# EAGLE design 235_temperature (EAGLE 9.6.2)
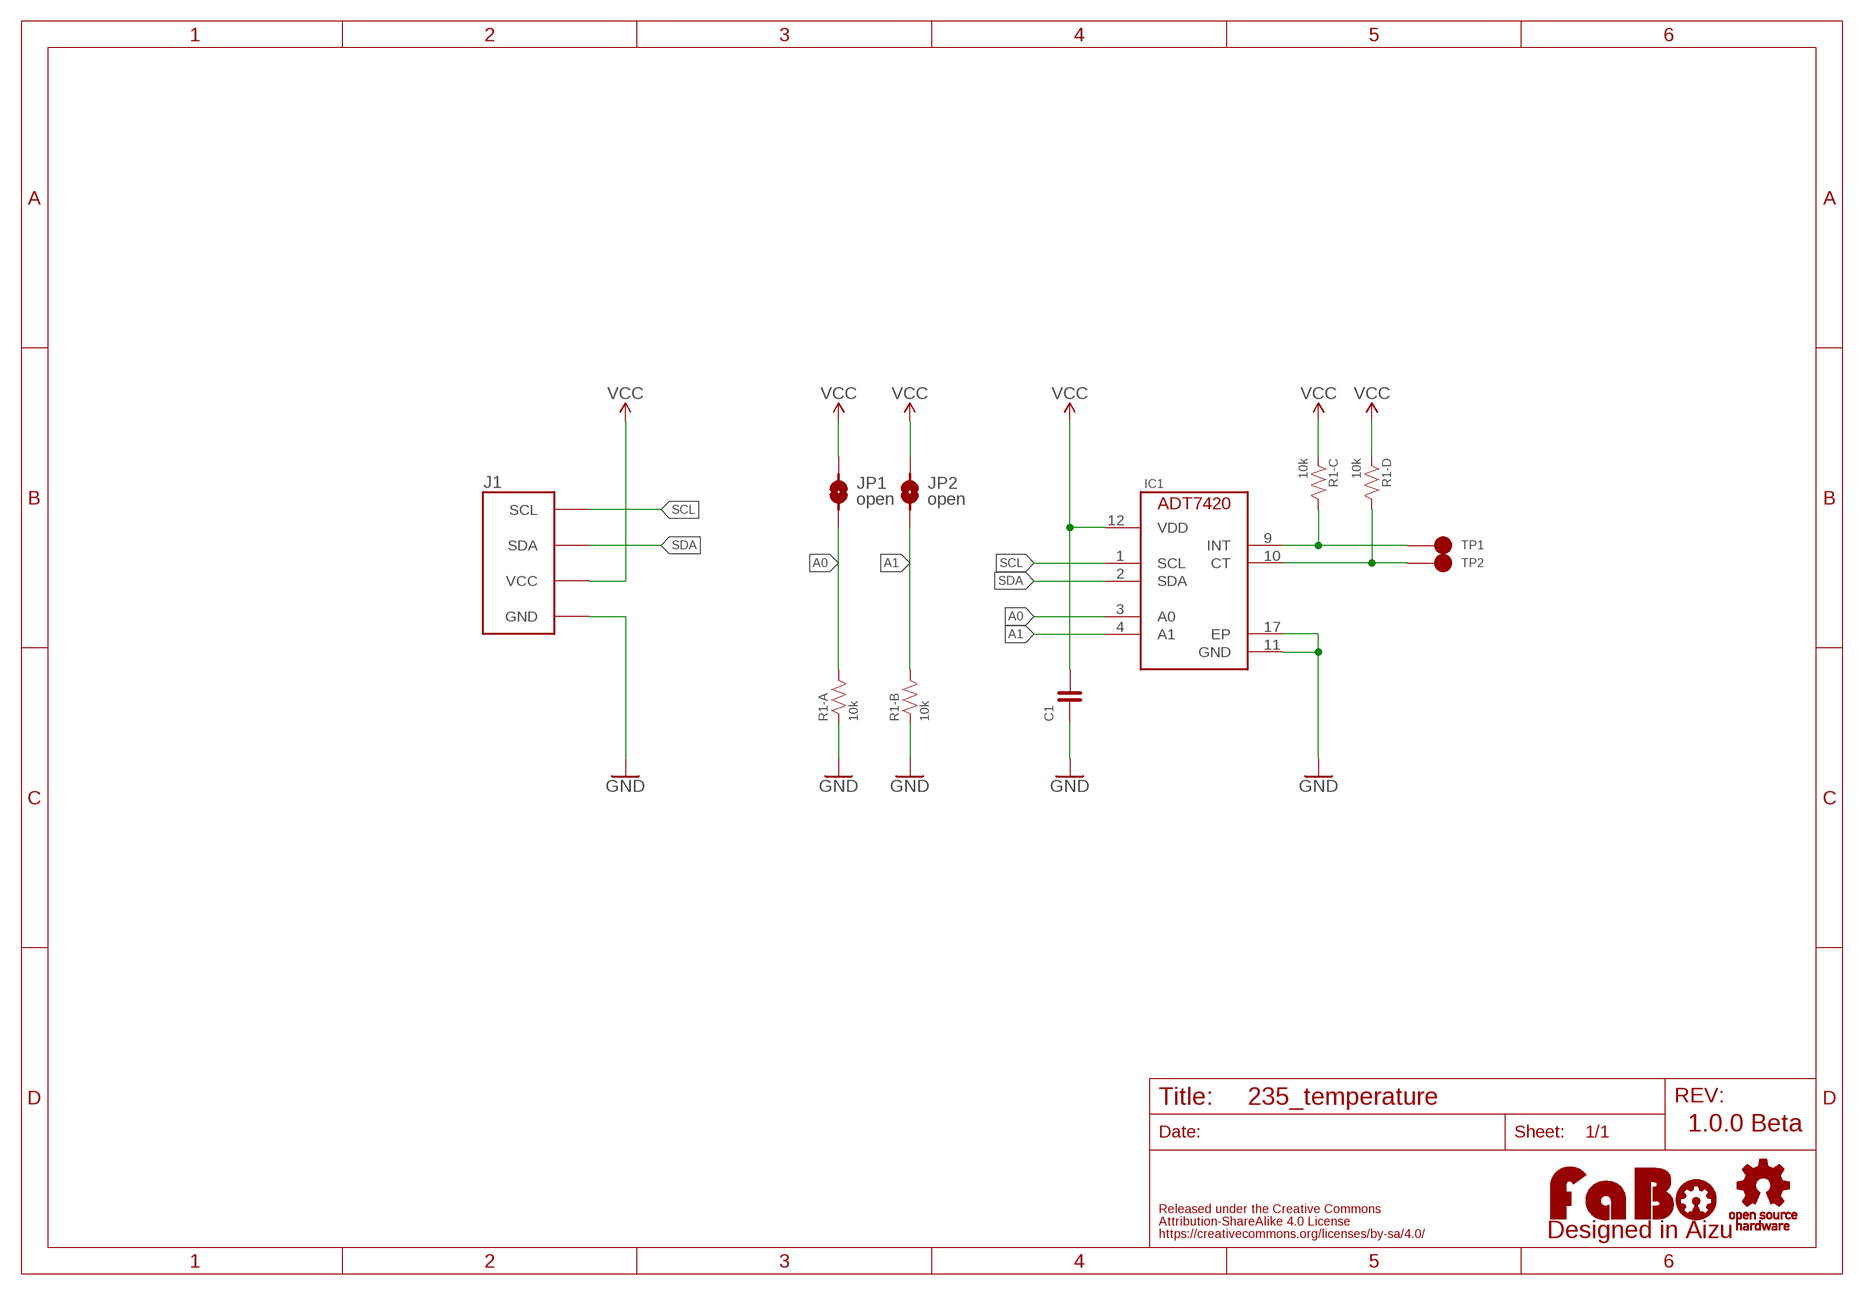
[diagram p0: schematic, sheet 1]

## Parts
C1  CAPACITOR-0603  [EIA0603]
IC1  ADT7420  [ADT7420]
J1  FABO_BRICK_I2C  [FABO_BRICK_I2C]
JP1  open  JUMPER-2_SMD  [JUMPER-SMD-2]
JP2  open  JUMPER-2_SMD  [JUMPER-SMD-2]
LOGO1  LOGO_FABO-M  [LOGO_FABO_M]
R1  10k  RESISTOR_ARRAY_4  [EXBV8V]
TP1  TP-15  [TP-15]
TP2  TP-15  [TP-15]
U$2  LOGO_OSHW-M_BOTTOM  [LOGO_OSHW_M_BOTTOM]

## Nets
A0: IC1.3(A0) JP1.2 R1.8
A1: IC1.4(A1) JP2.2 R1.7
CT: IC1.10(CT) R1.5 TP2.1
GND: C1.1 IC1.11(GND) IC1.17(EP) J1.GND R1.1 R1.2
INT: IC1.9(INT) R1.6 TP1.1
SCL: IC1.1(SCL) J1.SCL
SDA: IC1.2(SDA) J1.SDA
VCC: C1.2 IC1.12(VDD) J1.VCC JP1.1 JP2.1 R1.3 R1.4

## Notes on the sheet
- 1.0.0 Beta

## Library data of the parts
C1 = component:CAPACITOR
IC1 = component:ADT7420
J1 = FaBo-Template:FABO_BRICK_I2C: FaBo Brick I2C
JP1 JP2 = component:JUMPER-2
LOGO1 = component:LOGO_FABO
R1 = component:RESISTOR_ARRAY_4
TP1 TP2 = component:TP
U$2 = FaBo-etc:LOGO_OSHW

## Board
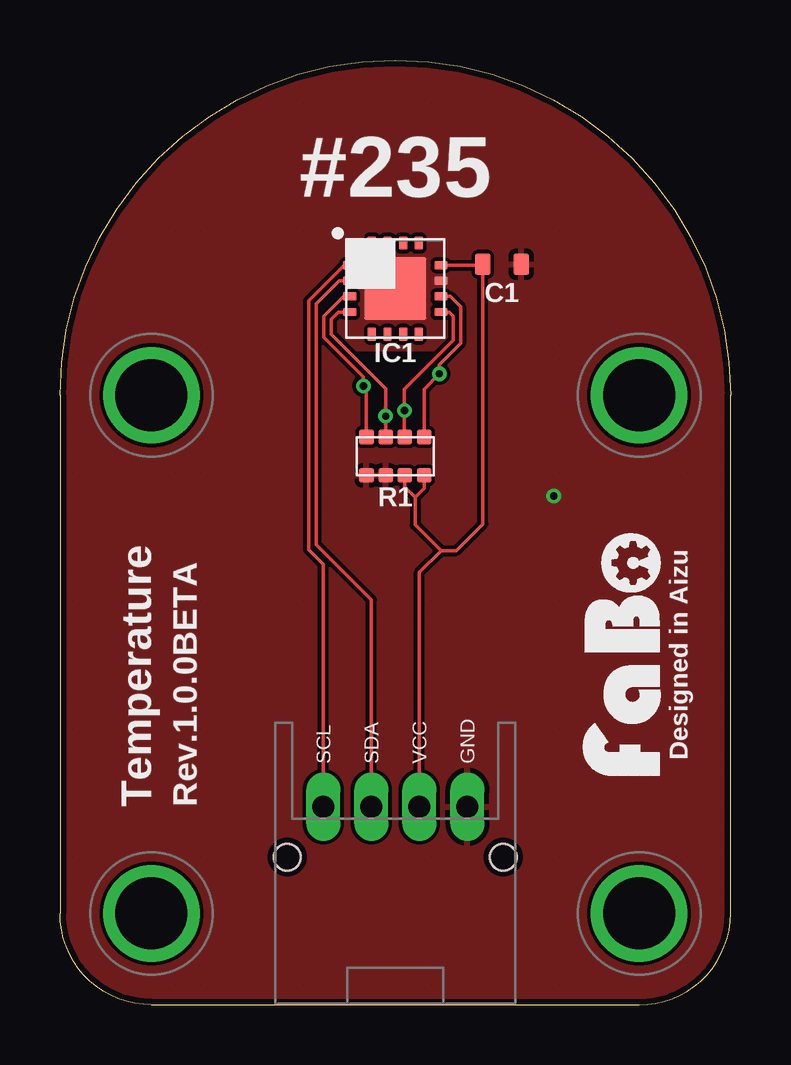
[diagram p1: board, top side]
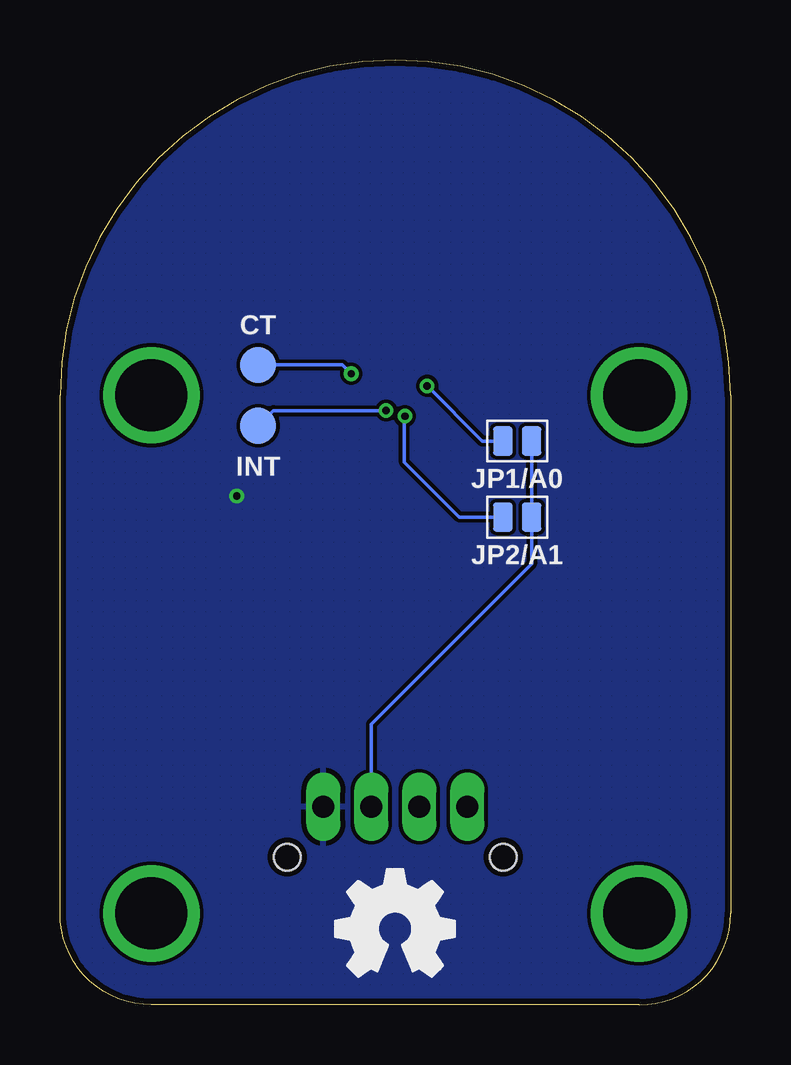
[diagram p2: board, bottom side, seen from below]

Size 27.94 x 39.37 mm. Coordinates in mm from the lower left corner, seen from the top.
Copper layers (1*16): Top 0.035mm / dielectric 1.6mm / Bottom 0.035mm
Design rules "PCBway": minimum track width 6mil, minimum drill 12mil, track to track 6mil, track to pad 6mil, pad to pad 6mil, via to via 6mil, smd to smd 6mil, copper to edge 10mil, drill to drill 10mil, minimum pad ring 10mil, minimum via ring 6mil, stop-mask expansion 2mil, vias tented up to drill 100mil, thermal gap 8mil

### Footprints (pad centres in the part's own frame; a part is rotated, then mirrored left to right if it is on the bottom)
EIA0603 = smd 0.65 x 0.9: 1 -0.8,0; 2 0.8,0
ADT7420 = smd 0.55 x 0.35: 1 -1.9,0.975; 2 -1.9,0.325; 3 -1.9,-0.325; 4 -1.9,-0.975; 9 1.9,-0.975; 10 1.9,-0.325; 11 1.9,0.325; 12 1.9,0.975 | smd 0.35 x 0.55: 5 -0.975,-1.9; 6 -0.325,-1.9; 7 0.325,-1.9; 8 0.975,-1.9; 13 0.975,1.9; 14 0.325,1.9; 15 -0.325,1.9; 16 -0.975,1.9 | smd 2.6 x 2.6: 17 0,0
FABO_BRICK_I2C = drill 0.9 pad 1.422 long: GND 3,-10.795; SCL -3,-10.795; SDA -1,-10.795; VCC 1,-10.795 | drill 3 pad 3.81: P$1 -10.16,6.35; P$2 10.16,6.35; P$3 -10.16,-15.24; P$4 10.16,-15.24 | hole 1.1: -4.5,-12.895; 4.5,-12.895
JUMPER-SMD-2 = smd 0.8 x 1.2: 1 -0.6,0; 2 0.6,0
EXBV8V = smd 0.6 x 0.6: 1 -1.2,-0.8; 2 -0.4,-0.8; 3 0.4,-0.8; 4 1.2,-0.8; 5 1.2,0.8; 6 0.4,0.8; 7 -0.4,0.8; 8 -1.2,0.8
TP-15 = smd 1.5 x 1.5: 1 0,0

### Placement (x,y rotation side)
C1  18.41,30.86 180 top
IC1  13.97,29.84 0 top
J1  13.97,19.05 0 top
JP1  8.89,23.5 180 bottom
JP2  8.89,20.32 180 bottom
LOGO1  25.4,14.61 90 top
R1  13.97,22.86 0 top
TP1  19.68,24.13 0 bottom
TP2  19.68,26.67 0 bottom
U$2  13.97,3.17 0 top

### Tracks (layer width: path | path; a pad name or v marks a point on that pad's centre or on a via)
A0  (via drill 0.3)
  Top 0.152: IC1.3 11.82,29.52 11,28.7 11,27.81 12.64,26.17 v12.64,25.79 12.77,25.66 R1.8
  Bottom 0.152: JP1.2 10.35,23.5 v12.64,25.79
A1  (via drill 0.3)
  Top 0.152: IC1.4 11.6,28.87 11.3,28.57 11.3,27.94 13.57,25.67 v13.57,24.53 R1.7
  Bottom 0.152: JP2.2 11.3,20.32 13.59,22.61 13.59,24.51 v13.57,24.53
CT  (via drill 0.3)
  Top 0.152: IC1.10 16.25,29.52 16.69,29.08 16.69,27.56 15.8,26.68 v15.8,26.3 15.17,25.66 R1.5
  Bottom 0.152: TP2.1 16.18,26.67 v15.8,26.3
GND  (via drill 0.3)
  other vias: 20.57,21.21
  pour Top (isolate 0.152, rank 3, hatched): 0,0 0,39.37 27.94,39.37 27.94,0
  pour Bottom (isolate 0.152, rank 3, hatched): 0,0 0,39.37 27.94,39.37 27.94,0
  pour Top (isolate 0.152, rank 2, no thermals): 11.43,32.38 16.51,32.38 16.51,27.3 11.43,27.3
INT  (via drill 0.3)
  Top 0.152: IC1.9 16.21,28.87 16.38,28.7 16.38,27.69 14.35,25.65 v14.35,24.77 14.35,23.68 R1.6
  Bottom 0.152: TP1.1 19.05,24.77 v14.35,24.77
SCL
  Top 0.152: IC1.1 11.85,30.82 10.36,29.34 10.36,18.97 10.97,18.37 J1.SCL
SDA
  Top 0.152: IC1.2 11.63,30.17 10.67,29.21 10.67,19.18 12.97,16.88 J1.SDA
VCC
  Top 0.152: 15.88,18.92 14.97,18.02 J1.VCC | 15.88,18.92 16.51,18.92 17.61,20.03 17.61,30.73 | 17.61,30.73 C1.2 | IC1.12 17.53,30.82 17.61,30.73 | 14.8,21.14 14.8,20 15.88,18.92 | R1.4 15.17,21.52 14.8,21.14 | R1.3 14.37,21.57 14.8,21.14
  Bottom 0.152: J1.VCC 14.97,11.7 8.29,18.38 JP2.1 JP1.1

### Text on the board
tPlace: #235 | Designed in Aizu | Temperature | Rev.1.0.0BETA
bPlace: CT | INT | JP1/A0 | JP2/A1